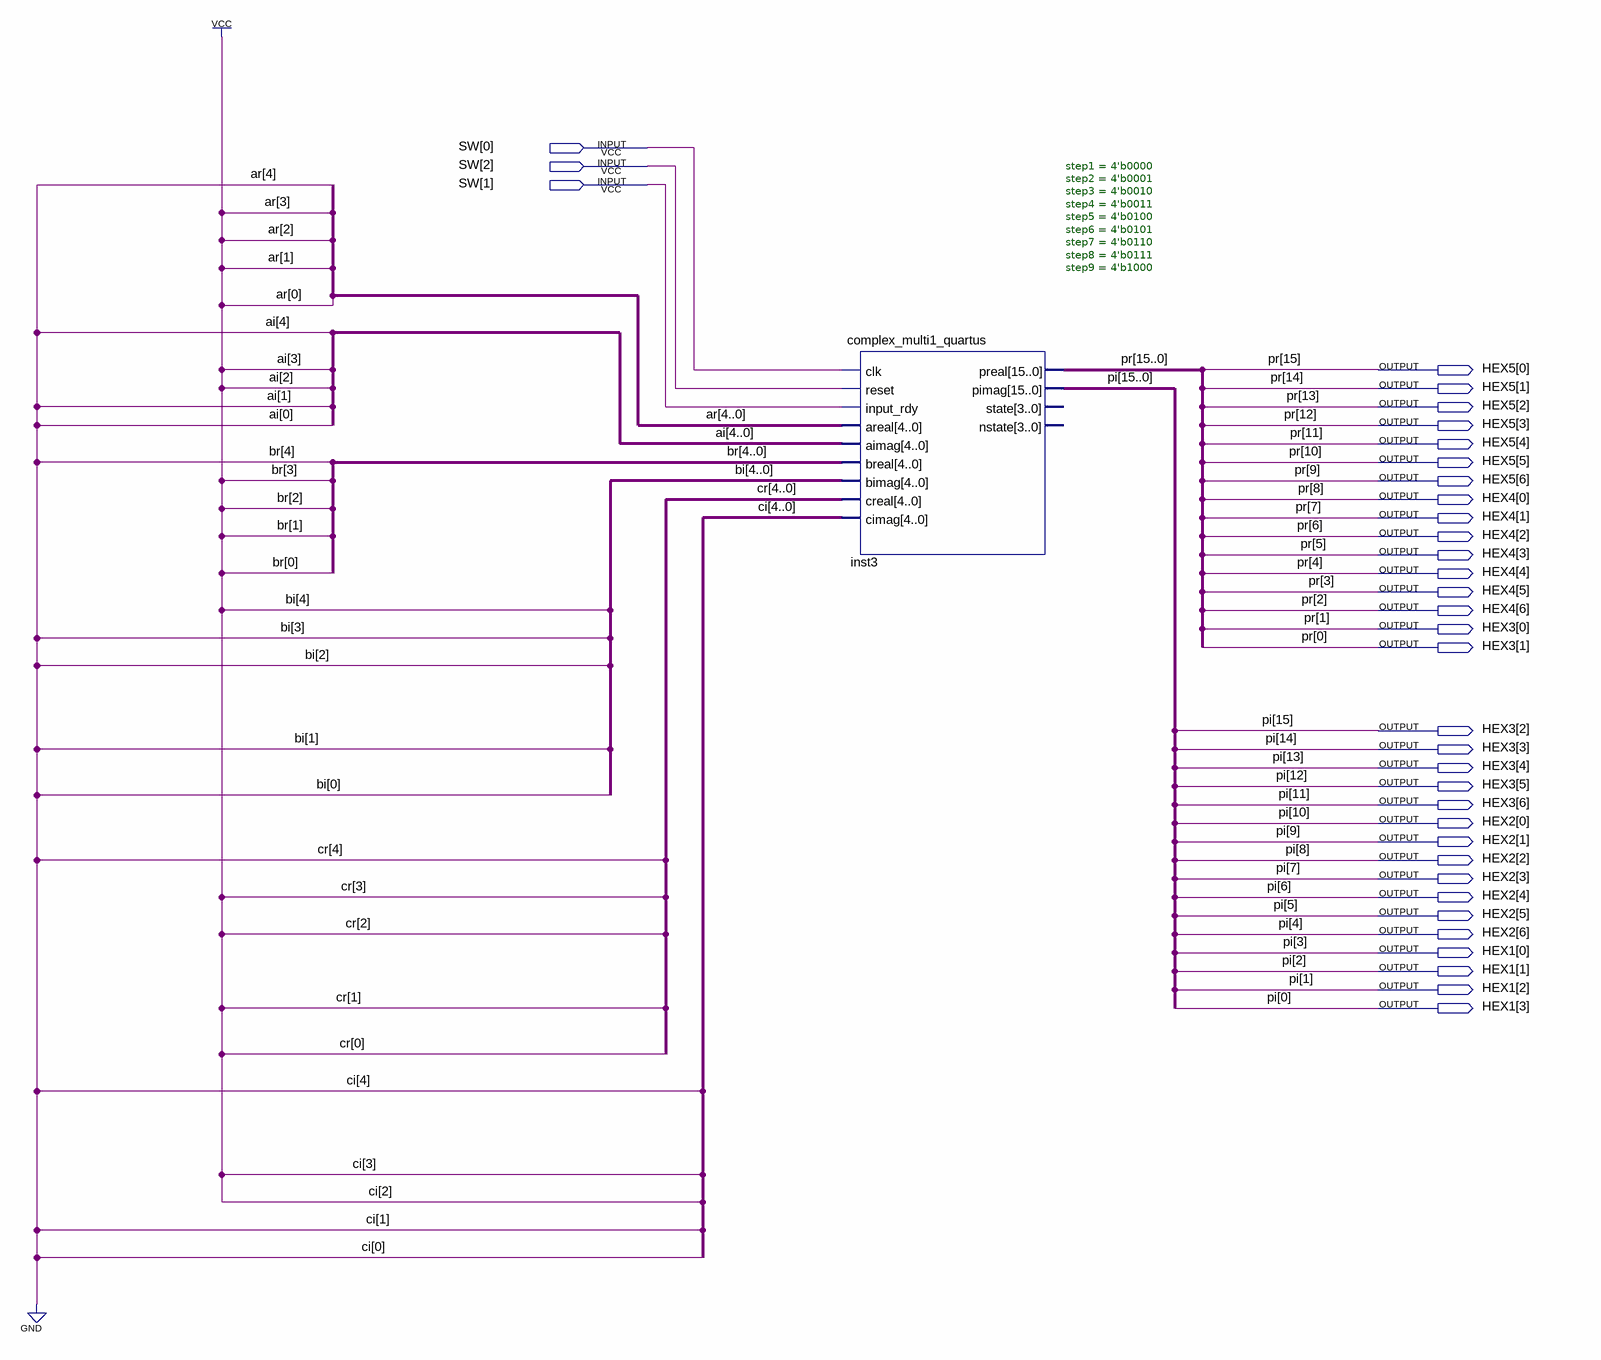
[diagram p0: schematic sheet]
// Quartus schematic cmultiplierA.bdf as structural Verilog: 1 symbols, 35 pins
module cmultiplierA (
  input  [2:0] SW,
  output [6:0] HEX5,
  output [6:0] HEX4,
  output [6:0] HEX3,
  output [6:0] HEX2,
  output [3:0] HEX1
);

  complex_multi1_quartus #(.step1(4'b0000), .step2(4'b0001), .step3(4'b0010), .step4(4'b0011), .step5(4'b0100), .step6(4'b0101), .step7(4'b0110), .step8(4'b0111), .step9(4'b1000)) inst3 (
    .clk(SW[0]), .reset(SW[2]), .input_rdy(SW[1]), .areal(5'b01111), .aimag(5'b01100), .breal(5'b01111),
    .bimag(5'b10000), .creal(5'b01111), .cimag(5'b01100),
    .preal({HEX5[0], HEX5[1], HEX5[2], HEX5[3], HEX5[4], HEX5[5], HEX5[6], HEX4[0], HEX4[1], HEX4[2], HEX4[3], HEX4[4], HEX4[5], HEX4[6], HEX3[0], HEX3[1]}),
    .pimag({HEX3[2], HEX3[3], HEX3[4], HEX3[5], HEX3[6], HEX2[0], HEX2[1], HEX2[2], HEX2[3], HEX2[4], HEX2[5], HEX2[6], HEX1[0], HEX1[1], HEX1[2], HEX1[3]}));  // open: state, nstate

  // Other names for the same wires on the sheet: pi[15:0] = {HEX3[2], HEX3[3], HEX3[4], HEX3[5], HEX3[6], HEX2[0], HEX2[1], HEX2[2], HEX2[3], HEX2[4], HEX2[5], HEX2[6], HEX1[0], HEX1[1], HEX1[2], HEX1[3]};
  //   pr[15:0] = {HEX5[0], HEX5[1], HEX5[2], HEX5[3], HEX5[4], HEX5[5], HEX5[6], HEX4[0], HEX4[1], HEX4[2], HEX4[3], HEX4[4], HEX4[5], HEX4[6], HEX3[0], HEX3[1]}
endmodule
